# EAGLE design ESP32BMS Manual (EAGLE 9.6.2)
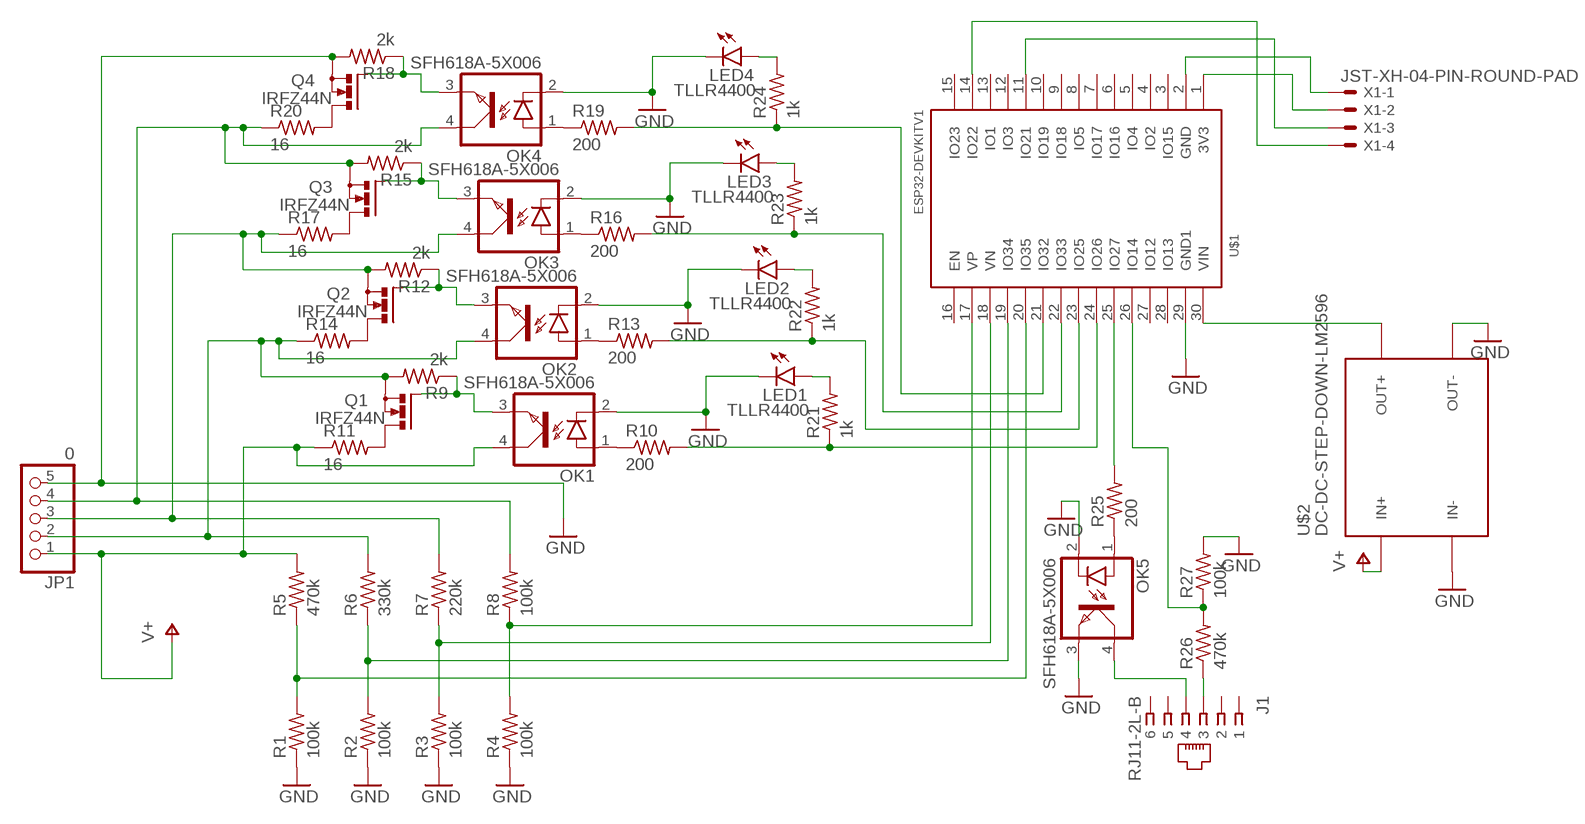
[diagram p0: schematic, sheet 1]

## Parts
J1  RJ11-2L-B  [RJ11-NO_SHIELD]
JP1  0  PINHD-1X5  [1X05]
LED1  TLLR4400  [LED3MM]
LED2  TLLR4400  [LED3MM]
LED3  TLLR4400  [LED3MM]
LED4  TLLR4400  [LED3MM]
OK1  SFH618A-5X006  [DIP4-400]
OK2  SFH618A-5X006  [DIP4-400]
OK3  SFH618A-5X006  [DIP4-400]
OK4  SFH618A-5X006  [DIP4-400]
OK5  SFH618A-5X006  [DIP4-400]
Q1  IRFZ44N  PMOSFET_NTO220BV  [TO220BV]
Q2  IRFZ44N  PMOSFET_NTO220BV  [TO220BV]
Q3  IRFZ44N  PMOSFET_NTO220BV  [TO220BV]
Q4  IRFZ44N  PMOSFET_NTO220BV  [TO220BV]
R1  100k  R-US_0204/7  [0204/7]
R2  100k  R-US_0204/7  [0204/7]
R3  100k  R-US_0204/7  [0204/7]
R4  100k  R-US_0204/7  [0204/7]
R5  470k  R-US_0204/7  [0204/7]
R6  330k  R-US_0204/7  [0204/7]
R7  220k  R-US_0204/7  [0204/7]
R8  100k  R-US_0204/7  [0204/7]
R9  2k  R-US_0204/7  [0204/7]
R10  200  R-US_0204/7  [0204/7]
R11  16  R-US_0414/5V  [0414V]
R12  2k  R-US_0204/7  [0204/7]
R13  200  R-US_0204/7  [0204/7]
R14  16  R-US_0414/5V  [0414V]
R15  2k  R-US_0204/7  [0204/7]
R16  200  R-US_0204/7  [0204/7]
R17  16  R-US_0414/5V  [0414V]
R18  2k  R-US_0204/7  [0204/7]
R19  200  R-US_0204/7  [0204/7]
R20  16  R-US_0414/5V  [0414V]
R21  1k  R-US_0204/7  [0204/7]
R22  1k  R-US_0204/7  [0204/7]
R23  1k  R-US_0204/7  [0204/7]
R24  1k  R-US_0204/7  [0204/7]
R25  200  R-US_0204/7  [0204/7]
R26  470k  R-US_0204/7  [0204/7]
R27  100k  R-US_0204/7  [0204/7]
U$1  ESP32DEVKITV1  [ESP32-DEVKITV1]
U$2  DC-DC-STEP-DOWN-LM2596  [DC-DC-STEP-DOWN-LM2596]
X1  JST-XH-04-PIN-ROUND-PAD  [JST-XH-04-PACKAGE-ROUND-PAD]

## Nets
GND: JP1.5 LED1.K(C) LED2.K(C) LED3.K(C) LED4.K(C) OK1.2(C) OK2.2(C) OK3.2(C) OK4.2(C) OK5.2(C) OK5.3(EMIT) Q4.S R1.1 R2.1 R3.1 R4.1 R18.2 R27.2 U$1.29(GND1) U$2.IN- U$2.OUT-
N$1: R4.2 R8.1 U$1.17(VP)
N$2: R3.2 R7.1 U$1.18(VN)
N$3: R2.2 R6.1 U$1.19(IO34)
N$4: R1.2 R5.1 U$1.20(IO35)
N$5: LED1.A R21.2
N$6: JP1.2 OK2.4(COL) Q1.S R6.2 R9.2 R14.1
N$7: JP1.3 OK3.4(COL) Q2.S R7.2 R12.2 R17.1
N$8: JP1.4 OK4.4(COL) Q3.S R8.2 R15.2 R20.1
N$9: OK1.1(A) R10.1
N$10: R19.2 R24.1 U$1.21(IO32)
N$11: OK2.1(A) R13.1
N$12: R16.2 R23.1 U$1.22(IO33)
N$13: R13.2 R22.1 U$1.23(IO25)
N$14: Q1.D R11.2
N$15: OK1.3(EMIT) Q1.G R9.1
N$16: R10.2 R21.1 U$1.24(IO26)
N$17: Q2.D R14.2
N$18: OK2.3(EMIT) Q2.G R12.1
N$19: U$1.30(VIN) U$2.OUT+
N$20: OK3.1(A) R16.1
N$21: LED2.A R22.2
N$22: Q3.D R17.2
N$23: OK3.3(EMIT) Q3.G R15.1
N$24: LED3.A R23.2
N$25: OK4.1(A) R19.1
N$26: LED4.A R24.2
N$27: Q4.D R20.2
N$28: OK4.3(EMIT) Q4.G R18.1
N$29: OK5.1(A) R25.1
N$30: R26.2 R27.1 U$1.26(IO14)
N$31: R25.2 U$1.25(IO27)
N$32: J1.3 R26.1
N$33: J1.4 OK5.4(COL)
N$34: U$1.1(3V3) X1.2
N$35: U$1.2(GND) X1.1
N$36: U$1.11(IO21) X1.3
N$37: U$1.14(IO22) X1.4
V+: JP1.1 OK1.4(COL) R5.2 R11.1 U$2.IN+
Unconnected: J1.1 J1.2 J1.5 J1.6 U$1.3(IO15) U$1.4(IO2) U$1.5(IO4) U$1.6(IO16) U$1.7(IO17) U$1.8(IO5) U$1.9(IO18) U$1.10(IO19) U$1.12(IO3) U$1.13(IO1) U$1.15(IO23) U$1.16(EN) U$1.27(IO12) U$1.28(IO13)

## Library data of the parts
J1 = con-tycoelectronics:RJ11: CORCOM Modular RJ Jacks No Shield Source: www.tycoelectronics.com .. ENG_DS_1654001_1099_RJ_L_0507.pdf; MF: TYCO ELECTRONICS; MPN: RJ11-2L-B; OC_FARNELL: unknown; OC_NEWARK: 83F4463
JP1 = pinhead:PINHD-1X5: PIN HEADER
LED1-LED4 = led:TLLR4400: Low Current (2mA) LED 3 mm Tinted Diffused Package color RED Source: Data sheet <http://www.farnell.com/datasheets/391100.pdf>; MF: VISHAY SEMICONDUCTOR; OC_FARNELL: 1612437
OK1-OK5 = optocoupler:SFH618?*: Optocoupler, Phototransistor Output, Low Input Current Source: Data sheet <http://www.vishay.com/docs/83673/sfh618.pdf>; OC_FARNELL: unknown; OC_NEWARK: unknown
Q1-Q4 = transistor-power:PMOSFET_N: Power MOSFET N-Channel
R1-R27 = rcl:R-US_: RESISTOR, American symbol; SPICEPREFIX: R
U$1 = ESP32-DEVKITV1Fix:ESP32DEVKITV1
U$2 = diy-modules:DC-DC-STEP-DOWN-LM2596: DC/DC Step-Down Regulator based on LM2596-ADJ chip LM2596 datasheet available here: http://www.ti.com/lit/ds/symlink/lm2596.pdf Click here to find device on ebay.com <http://www.ebay.com/sch/lm2596+power+regulator>
X1 = Rembrandt Electronics - JST XH Connectors v1-0:JST-XH-04-PIN: JST XH Connector 2 Pin Wire to board connector. Pitch: 2,54 mm, (0.100") Number of pins: 4 Created by Rembrandt Electronics www.rembrandtelectronics.com

## Board
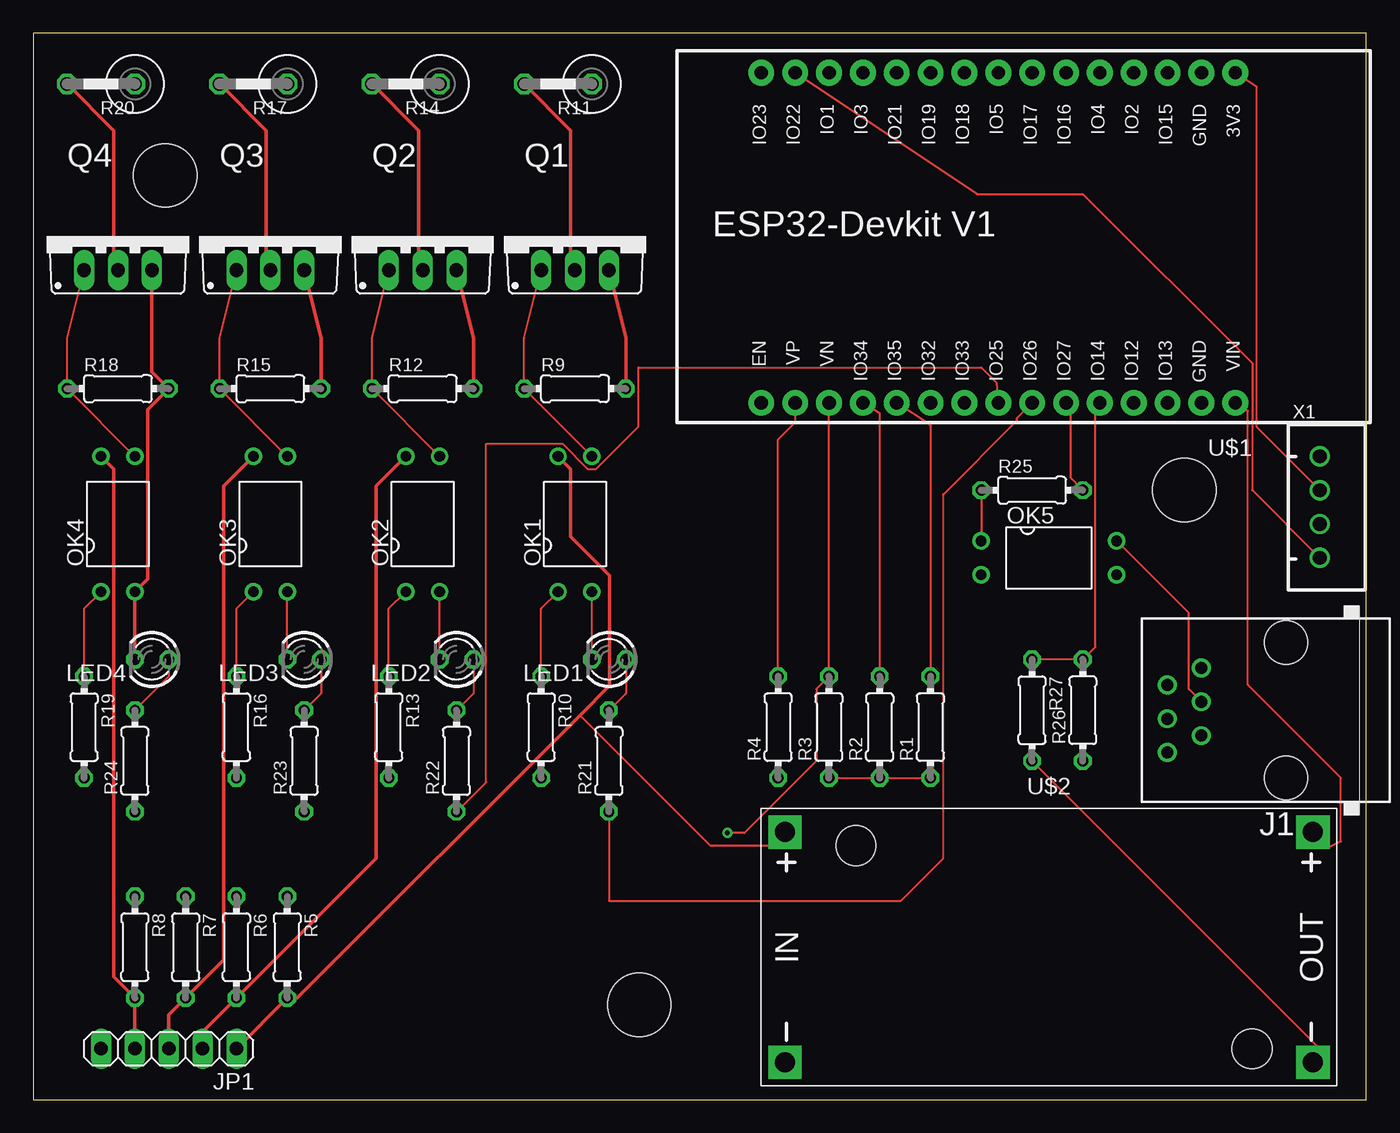
[diagram p1: board, top side]
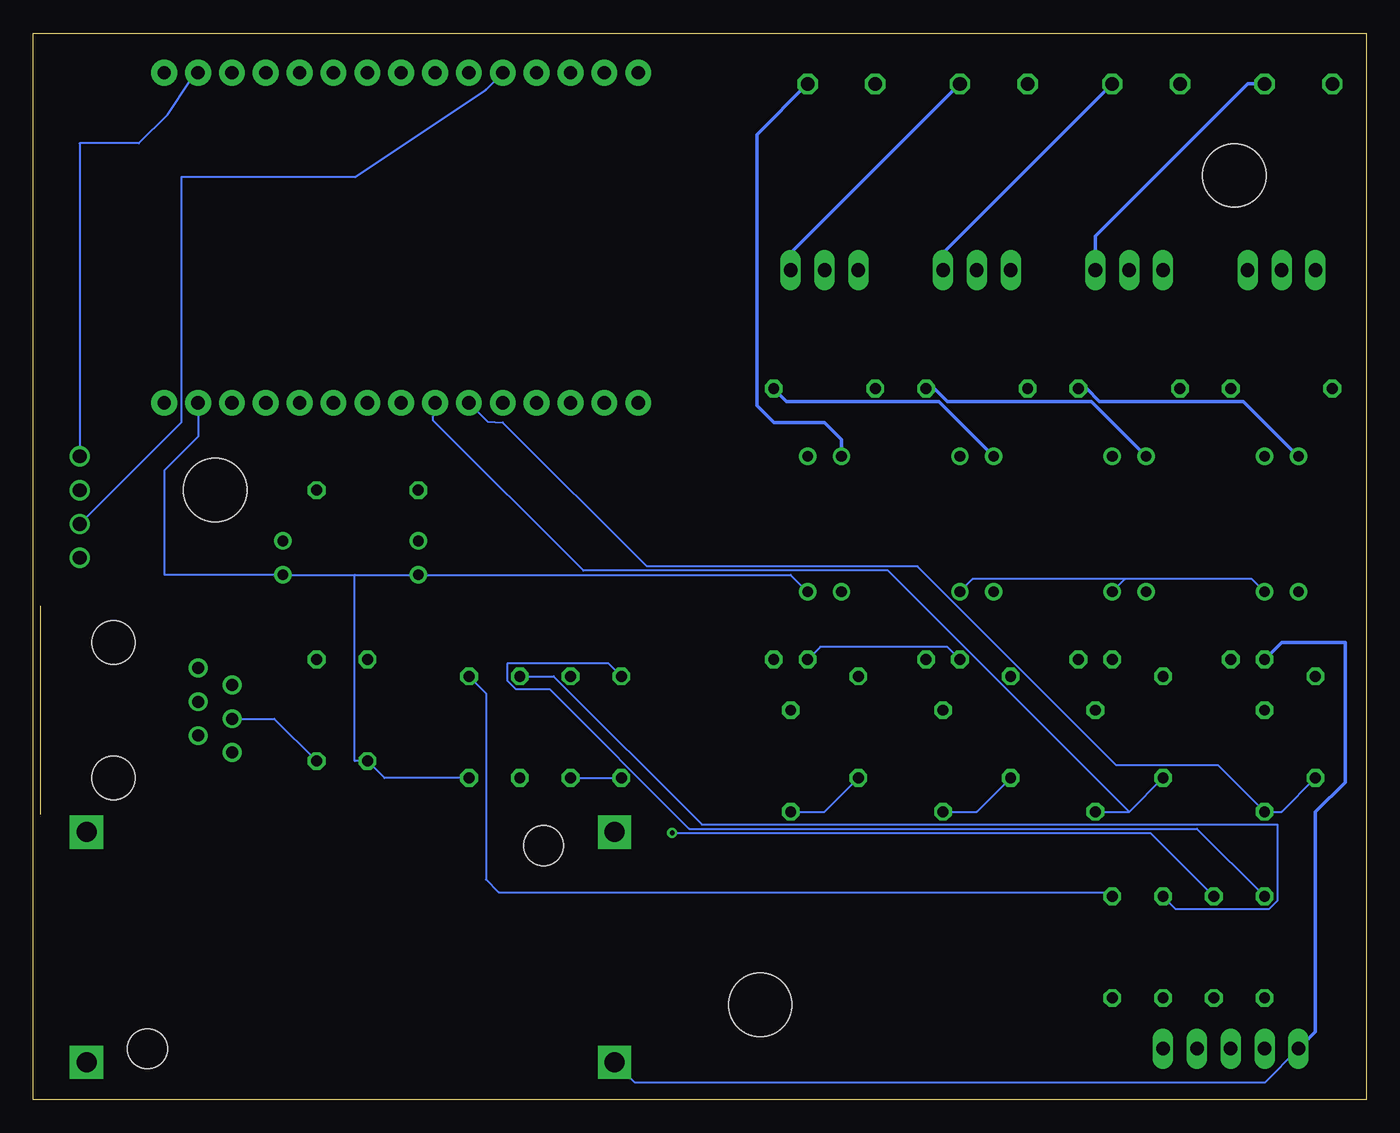
[diagram p2: board, bottom side, seen from below]

Size 100 x 80 mm. Coordinates in mm from the lower left corner, seen from the top.
Outline: 0,0 100,0 100,80 0,80 0,0
Copper layers (1*16): Top 0.035mm / dielectric 1.5mm / Bottom 0.035mm
Design rules "default": minimum track width 6mil, minimum drill 0.35mm, track to track 6mil, track to pad 6mil, pad to pad 6mil, via to via 6mil, smd to smd 6mil, copper to edge 40mil, drill to drill 6mil, minimum pad ring 10mil, minimum via ring 8mil, stop-mask expansion 4mil, vias tented up to drill 0mil, thermal gap 10mil
Holes 4.76 mm at 9.91,69.34 86.36,45.72 45.47,7.11

### Footprints (pad centres in the part's own frame; a part is rotated, then mirrored left to right if it is on the bottom)
RJ11-NO_SHIELD = drill 0.9 pad 1.4: 1 -3.175,8.89; 2 -1.905,6.35; 3 -0.635,8.89; 4 0.635,6.35; 5 1.905,8.89; 6 3.175,6.35 | hole 3.251: -5.08,0; 5.08,0
1X05 = drill 1.016 long: 1 -5.08,0; 2 -2.54,0; 3 0,0; 4 2.54,0; 5 5.08,0
LED3MM = drill 0.813 octagon: A -1.27,0; K 1.27,0
DIP4-400 = drill 0.8: 1 -1.27,-5.08; 2 1.27,-5.08; 3 1.27,5.08; 4 -1.27,5.08
TO220BV = drill 1.016 long: D 0,-2.54; G -2.54,-2.54; S 2.54,-2.54
0204/7 = drill 0.813 octagon: 1 -3.81,0; 2 3.81,0
0414V = drill 1.016 octagon: 1 -2.54,0; 2 2.54,0
ESP32-DEVKITV1 = drill 1 pad 1.93: 1 -22.87,-13.54; 2 -20.33,-13.54; 3 -17.79,-13.54; 4 -15.25,-13.54; 5 -12.71,-13.54; 6 -10.17,-13.54; 7 -7.63,-13.54; 8 -5.09,-13.54; 9 -2.55,-13.54; 10 -0.01,-13.54; 11 2.53,-13.54; 12 5.07,-13.54; 13 7.61,-13.54; 14 10.15,-13.54; 15 12.69,-13.54; 16 12.69,11.23; 17 10.15,11.23; 18 7.61,11.23; 19 5.07,11.23; 20 2.53,11.23; 21 -0.01,11.23; 22 -2.55,11.23; 23 -5.09,11.23; 24 -7.63,11.23; 25 -10.17,11.23; 26 -12.71,11.23; 27 -15.25,11.23; 28 -17.79,11.23; 29 -20.33,11.23; 30 -22.87,11.23
DC-DC-STEP-DOWN-LM2596 = drill 1.5 pad 2.5 square: IN+ -19.812,8.636; IN- -19.812,-8.636; OUT+ 19.812,8.636; OUT- 19.812,-8.636 | hole 3: -14.478,7.62; 15.24,-7.62
JST-XH-04-PACKAGE-ROUND-PAD = drill 1.016: 1 -3.81,0; 2 -1.27,0; 3 1.27,0; 4 3.81,0

### Placement (x,y rotation side)
J1  93.98,29.21 90 top
JP1  10.16,3.81 180 top
LED1  43.18,33.02 180 top
LED2  31.75,33.02 180 top
LED3  20.32,33.02 180 top
LED4  8.89,33.02 180 top
OK1  40.64,43.18 0 top
OK2  29.21,43.18 0 top
OK3  17.78,43.18 0 top
OK4  6.35,43.18 0 top
OK5  76.2,40.64 270 top
Q1  40.64,64.77 0 top
Q2  29.21,64.77 0 top
Q3  17.78,64.77 0 top
Q4  6.35,64.77 0 top
R1  67.31,27.94 90 top
R2  63.5,27.94 90 top
R3  59.69,27.94 90 top
R4  55.88,27.94 90 top
R5  19.05,11.43 270 top
R6  15.24,11.43 270 top
R7  11.43,11.43 270 top
R8  7.62,11.43 270 top
R9  40.64,53.34 0 top
R10  38.1,27.94 270 top
R11  39.37,76.2 180 top
R12  29.21,53.34 0 top
R13  26.67,27.94 270 top
R14  27.94,76.2 180 top
R15  17.78,53.34 0 top
R16  15.24,27.94 270 top
R17  16.51,76.2 180 top
R18  6.35,53.34 0 top
R19  3.81,27.94 270 top
R20  5.08,76.2 180 top
R21  43.18,25.4 90 top
R22  31.75,25.4 90 top
R23  20.32,25.4 90 top
R24  7.62,25.4 90 top
R25  74.93,45.72 0 top
R26  78.74,29.21 90 top
R27  74.93,29.21 270 top
U$1  67.31,63.5 180 top
U$2  76.2,11.43 0 top
X1  96.52,44.45 270 top

### Tracks (layer width: path | path; a pad name or v marks a point on that pad's centre or on a via)
GND
  Top 0.152: LED1.K OK1.2 | LED2.K OK2.2 | LED3.K OK3.2 | R3.1 R2.1 R1.1 | R27.2 96.52,3.81 96.52,3.49 96.01,3.24 U$2.OUT-
  Top 0.254: Q4.S 8.89,54.61 R18.2 8.57,51.75 8.57,39.05 OK4.2 LED4.K
  Bottom 0.152: 18.1,39.05 OK3.2 | 18.1,39.05 8.57,39.05 OK4.2 | OK2.2 29.53,39.05 18.1,39.05 | LED1.K 40.96,33.97 31.43,33.97 LED2.K | 75.88,39.37 OK5.3 90.17,39.37 90.17,47.2 87.64,49.73 U$1.29 | 75.88,39.37 OK5.2 43.18,39.37 OK1.2 | R3.1 R4.1 | R1.1 73.66,24.13 R27.2 75.88,25.4 75.88,39.37 | JP1.5 7.62,1.27 54.86,1.27 U$2.IN-
  Bottom 0.254: JP1.5 3.81,5.08 3.81,21.59 1.59,23.81 1.59,34.29 6.35,34.29 LED4.K
N$1
  Top 0.152: U$1.17 57.16,50.81 55.88,49.53 R4.2
  Bottom 0.152: R8.1 12.7,20.32 50.8,20.32 61.28,30.8 63.82,30.8 64.45,31.43 64.45,32.7 56.83,32.7 R4.2
N$2  (via drill 0.35)
  Top 0.152: v52.07,20 53.34,20 58.74,25.4 58.74,30.8 R3.2 59.69,52.07 U$1.18
  Bottom 0.152: R7.1 16.19,20 v52.07,20
N$3
  Top 0.152: R2.2 63.5,51.45 U$1.19
  Bottom 0.152: R6.1 14.29,14.29 7.3,14.29 6.67,14.92 6.67,20.64 49.85,20.64 60.96,31.75 R2.2
N$4
  Top 0.152: U$1.20 67.31,50.62 R1.2
  Bottom 0.152: R5.1 19.37,15.56 65.09,15.56 66.04,16.51 66.04,30.48 R1.2
N$5
  Top 0.152: R21.2 44.45,30.48 LED1.A
N$6
  Top 0.254: JP1.2 12.7,5.08 R6.2 25.72,18.1 25.72,46.04 OK2.4 | Q1.S 44.45,57.15 R9.2
  Bottom 0.254: OK2.4 32.07,52.39 43.5,52.39 R9.2 | R14.1 43.18,63.5 Q1.S
N$7
  Top 0.254: JP1.3 10.16,6.35 R7.2 14.29,10.48 14.29,46.04 OK3.4 | Q2.S 33.02,57.15 R12.2
  Bottom 0.152: R12.2 32.38,53.34
  Bottom 0.254: OK3.4 20.64,52.39 31.43,52.39 32.38,53.34 | R17.1 31.75,63.5 Q2.S
N$8
  Top 0.254: JP1.4 R8.2 6.03,9.21 6.03,47.31 OK4.4 | Q3.S 21.59,57.15 R15.2
  Bottom 0.152: R15.2 20.95,53.34
  Bottom 0.254: OK4.4 9.21,52.39 20,52.39 20.95,53.34 | R20.1 8.89,76.2 20.32,64.77 Q3.S
N$9
  Top 0.152: OK1.1 38.1,36.83 R10.1
N$10
  Bottom 0.152: R19.2 6.35,21.59 R24.1 11.11,25.08 18.73,25.08 33.66,40.01 53.98,40.01 64.78,50.81 65.92,50.87 U$1.21
N$11
  Top 0.152: OK2.1 26.67,36.83 R13.1
N$12
  Bottom 0.152: 17.78,21.59 R16.2 | R23.1 17.78,21.59 | 17.78,21.59 35.88,39.69 58.74,39.69 69.99,50.94 69.93,52.2 U$1.22
N$13
  Top 0.152: R22.1 33.97,23.81 33.97,49.21 39.69,49.21 41.59,47.31 42.23,47.31 45.4,50.48 45.4,54.93 71.12,54.93 72.27,53.78 U$1.23
  Bottom 0.152: R13.2 29.21,21.59 R22.1
N$14
  Top 0.254: R11.2 40.32,72.71 40.32,62.55 Q1.D
N$15
  Top 0.152: OK1.3 R9.1 36.83,57.15 Q1.G
N$16
  Top 0.152: R21.1 43.18,14.92 65.09,14.92 68.26,18.1 68.26,45.4 73.8,50.94 73.79,51.12 U$1.24
  Bottom 0.152: R10.2 40.64,21.59 R21.1
N$17
  Top 0.254: R14.2 28.89,72.71 28.89,62.55 Q2.D
N$18
  Top 0.152: OK2.3 R12.1 25.4,57.15 Q2.G
N$19
  Top 0.152: U$1.30 91.12,51.66 91.12,31.11 98.11,24.13 98.11,19.37 97.18,18.9 U$2.OUT+
N$20
  Top 0.152: OK3.1 15.24,36.83 R16.1
N$21
  Top 0.152: R22.2 33.02,30.48 LED2.A
N$22
  Top 0.254: R17.2 17.46,72.71 17.46,62.55 Q3.D
N$23
  Top 0.152: OK3.3 R15.1 13.97,57.15 Q3.G
N$24
  Top 0.152: R23.2 21.59,30.48 LED3.A
N$25
  Top 0.152: OK4.1 3.81,36.83 R19.1
N$26
  Top 0.152: R24.2 10.16,31.75 LED4.A
N$27
  Top 0.254: R20.2 6.03,72.71 6.03,71.12 6.03,62.55 Q4.D
N$28
  Top 0.152: OK4.3 R18.1 2.54,57.15 Q4.G
N$29
  Top 0.152: R25.1 OK5.1
N$30
  Top 0.152: R27.1 R26.2 79.69,33.97 79.69,52.25 U$1.26
N$31
  Top 0.152: R25.2 77.79,46.67 77.79,52.07 U$1.25
N$32
  Bottom 0.152: R26.1 81.92,28.57 J1.3
N$33
  Top 0.152: OK5.4 86.68,36.51 86.68,30.8 J1.4
N$34
  Top 0.152: X1.2 91.76,50.48 91.76,75.99 U$1.1
N$35
  Bottom 0.152: X1.1 96.52,71.75 92.08,71.75 89.92,73.91 88.22,76.46 U$1.2
N$36
  Bottom 0.152: X1.3 88.9,50.8 88.9,69.22 75.88,69.22 66.05,75.77 | U$1.11 66.05,75.77 | 66.05,75.77
N$37
  Top 0.152: X1.4 91.44,45.72 91.44,55.24 78.74,67.94 70.8,67.94 U$1.14
V+
  Top 0.152: 41.02,28.83 50.8,19.05 55.63,19.05 U$2.IN+
  Top 0.254: JP1.1 R5.2 19.81,7.62 41.02,28.83 43.24,31.05 43.24,39.31 40.32,42.23 40.32,47.31 OK1.4
  Bottom 0.254: R11.1 45.72,72.39 45.72,52.07 44.45,50.8 40.64,50.8 39.37,49.53 OK1.4